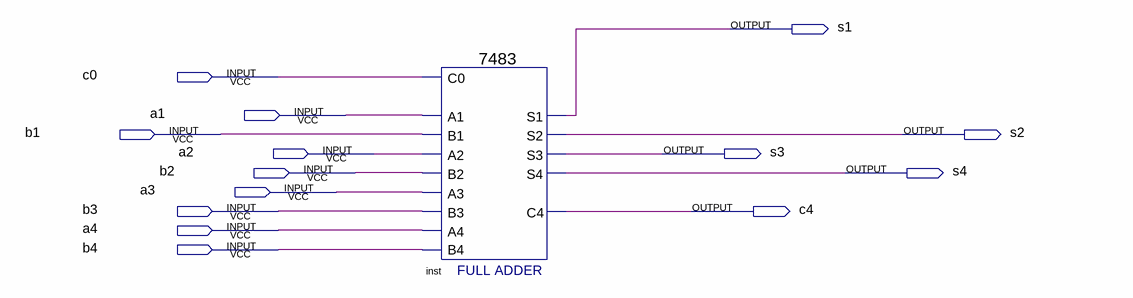
[diagram p0: schematic sheet]
// Quartus schematic fourB.bdf as structural Verilog: 1 symbols, 14 pins
module fourB (
  input  c0,
  input  a1,
  input  b1,
  input  a2,
  input  b2,
  input  a3,
  input  b3,
  input  a4,
  input  b4,
  output s1,
  output s2,
  output s3,
  output s4,
  output c4
);

  \7483  inst (
    .B4(b4), .C0(c0), .A1(a1), .A2(a2), .B1(b1), .B2(b2), .A3(a3), .B3(b3), .A4(a4), .S3(s3), .S4(s4),
    .S2(s2), .C4(c4), .S1(s1));
endmodule
